# EAGLE design NXP_Smart_Charger (EAGLE 8.4.2)
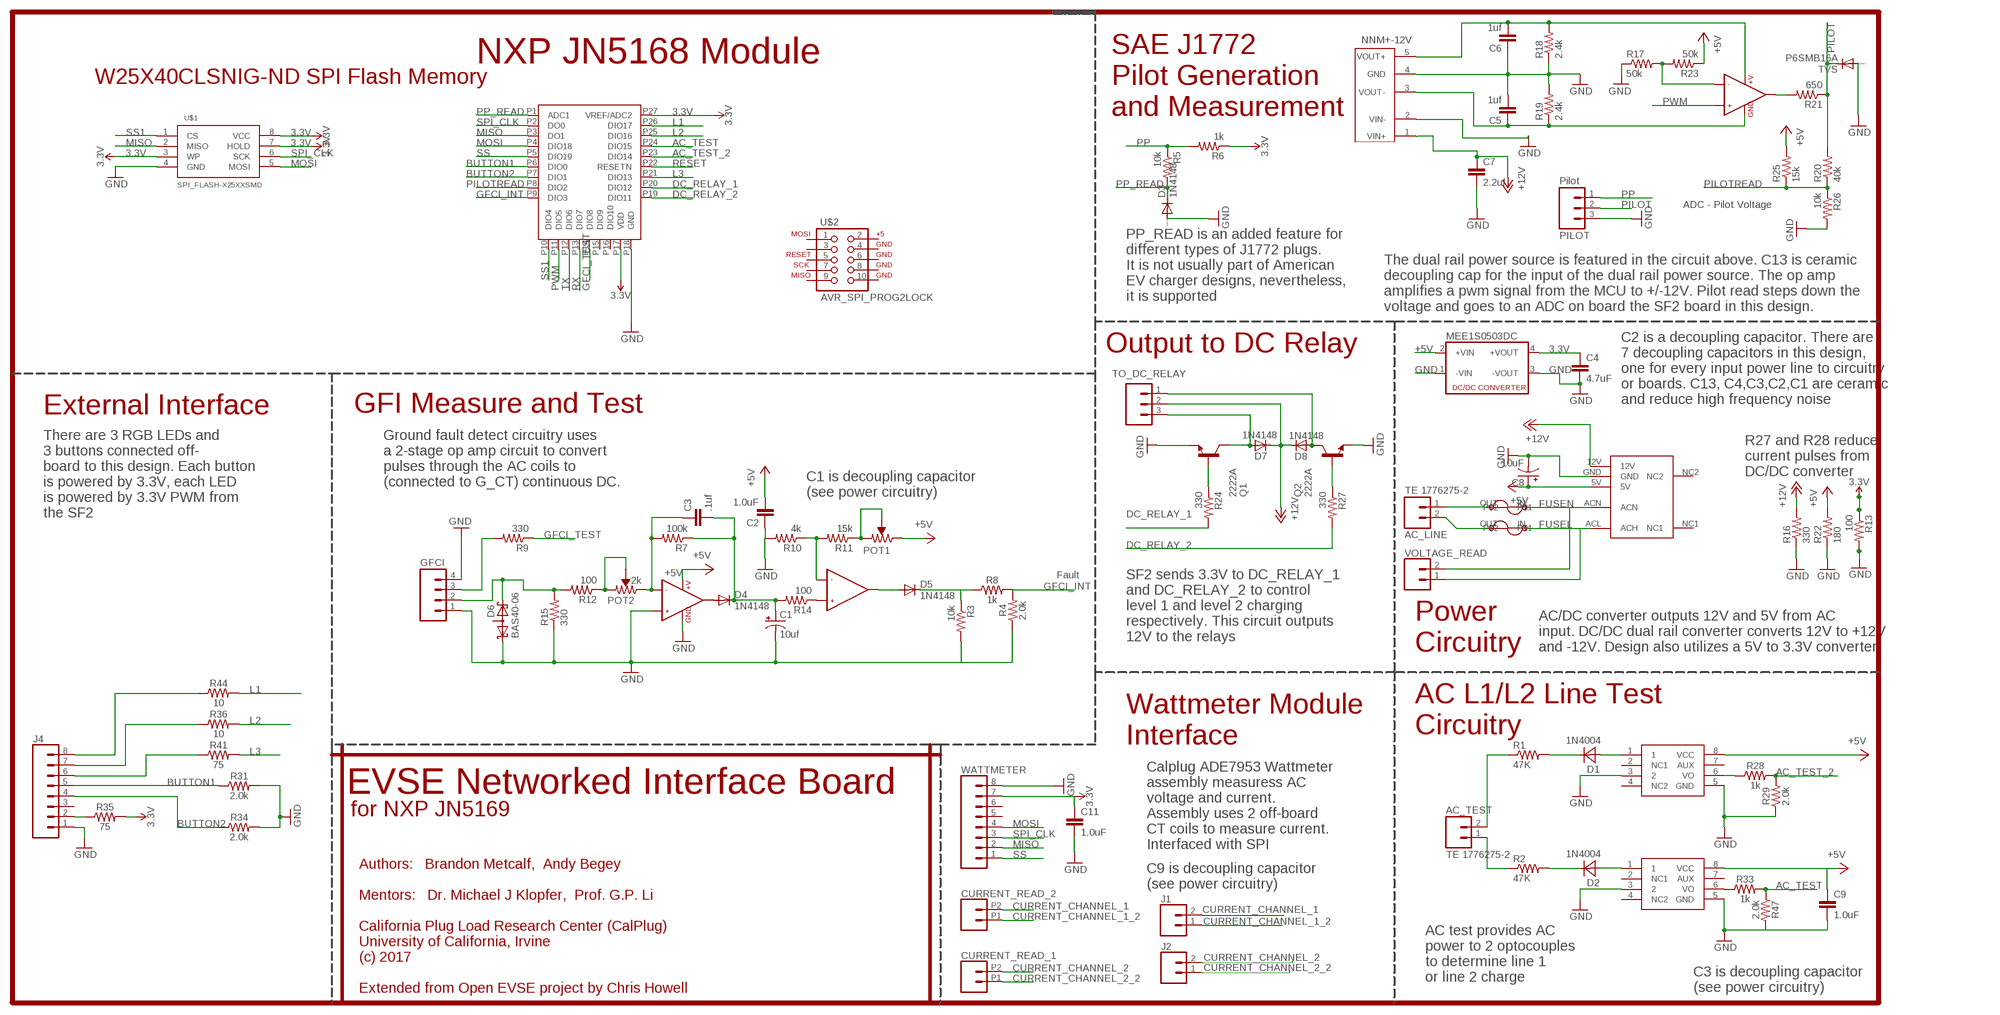
[diagram p0: schematic, sheet 1]

## Parts
AC_LINE  TE 1776275-2  M023.5MM_LOCK  [SCREWTERMINAL-3.5MM-2_LOCK]
AC_TEST  TE 1776275-2  M023.5MM_LOCK  [SCREWTERMINAL-3.5MM-2_LOCK]
C1  10uf  CAP_POL1206  [EIA3216]
C2  1.0uF  1.0UF-0805-25V-(+80/-20%)  [0805]
C3  .1uf  CAP0805  [0805]
C4  4.7uF  1.0UF-0805-25V-(+80/-20%)  [0805]
C5  1uf  CAP0805  [0805]
C6  1uf  CAP0805  [0805]
C7  2.2uf  CAP0805  [0805]
C8  10uF  10UF-POLAR-EIA3216-16V-10%(TANT)  [EIA3216]
C9  1.0uF  1.0UF-0805-25V-(+80/-20%)  [0805]
C11  1.0uF  1.0UF-0805-25V-(+80/-20%)  [0805]
CURRENT_READ_1  CONN_022.54MM_SCREWTERM  [1X02_2.54_SCREWTERM]
CURRENT_READ_2  CONN_022.54MM_SCREWTERM  [1X02_2.54_SCREWTERM]
D1  1N4004  MBRA340T3  [SMA]
D2  1N4004  MBRA340T3  [SMA]
D3  1N4148  DIODE-SOD123  [SOD123]
D4  1N4148  DIODE-SOD123  [SOD123]
D5  1N4148  DIODE-SOD123  [SOD123]
D6  BAS40-06  [SOT23]
D7  1N4148  DIODE-SOD123  [SOD123]
D8  1N4148  DIODE-SOD123  [SOD123]
DC1  MPM-04E-1205  [MPM-04E-1205]
DC2  NNM+-12V  [DIP_5]
F1  BEL1AFUSE  [BELFUSE1A]
F2  BEL1AFUSE  [BELFUSE1A]
GFCI  M04LOCK  [1X04_LOCK]
IC1  MID400  [DIP08]
IC2  MID400  [DIP08]
IC3  LMV358  [SO08]
IC4  LMV358  [SO08]
J1  CONN_02  [1X02]
J2  CONN_02  [1X02]
J4  CONN_08"  [1X08]
JN5168  NXP_JN5168-001-MO3  [MODULE]
MEE1S0503DC  NKE0305DC  [4SIL]
PILOT  Pilot  M03SCREW_LOCK  [SCREWTERMINAL-3.5MM-3_LOCK.007S]
POT1  10k  PVG3G  [PV3G]
POT2  2k  PVG3G  [PV3G]
Q1  2222A  BCX70SMD  [SOT23]
Q2  2222A  BCX70SMD  [SOT23]
R1  47K  RESISTORPTH-1/4W  [AXIAL-0.4]
R2  47K  RESISTORPTH-1/4W  [AXIAL-0.4]
R3  10k  RESISTOR0603-RES  [0603-RES]
R4  2.0k  2.0KOHM-0603-1/10W-5%  [0603]
R5  10k  RESISTOR0603-RES  [0603-RES]
R6  1k  RESISTOR0603-RES  [0603-RES]
R7  100k  RESISTOR0805-RES  [0805]
R8  1k  1KOHM-0603-1/10W-1%  [0603]
R9  330  RESISTOR0603-RES  [0603-RES]
R10  4k  RESISTOR0603-RES  [0603-RES]
R11  15k  RESISTOR0603-RES  [0603-RES]
R12  100  RESISTOR0603-RES  [0603-RES]
R13  100  RESISTOR0603-RES  [0603-RES]
R14  100  RESISTOR0603-RES  [0603-RES]
R15  330  RESISTOR0603-RES  [0603-RES]
R16  330  R-US_R0603  [R0603]
R17  50k  RESISTOR0805-RES  [0805]
R18  2.4k  RESISTOR0603-RES  [0603-RES]
R19  2.4k  RESISTOR0603-RES  [0603-RES]
R20  40k  RESISTOR0603-RES  [0603-RES]
R21  650  RESISTOR0603-RES  [0603-RES]
R22  180  R-US_R0603  [R0603]
R23  50k  RESISTOR0805-RES  [0805]
R24  330  RESISTOR0603-RES  [0603-RES]
R25  15k  RESISTOR0603-RES  [0603-RES]
R26  10k  RESISTOR0603-RES  [0603-RES]
R27  330  RESISTOR0805-RES  [0805]
R28  1k  1KOHM-0603-1/10W-1%  [0603]
R29  2.0k  2.0KOHM-0603-1/10W-5%  [0603]
R31  2.0k  2.0KOHM-0603-1/10W-5%  [0603]
R33  1k  1KOHM-0603-1/10W-1%  [0603]
R34  2.0k  2.0KOHM-0603-1/10W-5%  [0603]
R35  75  75KOHM-0603-1/10W-1%  [0603]
R36  10  10OHM-0603-1/10W-1%  [0603]
R41  75  75KOHM-0603-1/10W-1%  [0603]
R44  10  10OHM-0603-1/10W-1%  [0603]
R47  2.0k  2.0KOHM-0603-1/10W-5%  [0603]
TO_DC_RELAY  M03SCREW_LOCK  [SCREWTERMINAL-3.5MM-3_LOCK.007S]
TVS  P6SMB16A  DIODE-SMB  [SMB]
U$1  SPI_FLASH-X25XXSMD  [SO08]
U$2  AVR_SPI_PROG2LOCK  [2X5-SHROUDED_LOCK]
VOLTAGE_READ  CONN_025MM  [SCREWTERMINAL-5MM-2]
WATTMETER  CONN_08"  [1X08]

## Nets
3.3V: C4.1 C11.1 JN5168.P17(VDD) JN5168.P27(VREF/ADC2) MEE1S0503DC.4(+VOUT) R6.1 R13.1 R35.2 U$1.3(WP) WATTMETER.7
12V: C6.2 DC2.5(VOUT+) IC4.8(+V) R18.2
+5V: C2.2 C8.+ C9.1 DC1.5V IC1.8(VCC) IC2.8(VCC) IC3.8(+V) MEE1S0503DC.2(+VIN) POT1.P$3(CW) R22.2 R23.1 R25.2
+12V: C7.1 D7.C D8.C DC1.12V DC2.1(VIN+) R16.2 TO_DC_RELAY.2
-12V: C5.1 DC2.3(VOUT-) IC4.4(GND) R19.1
AC_TEST: JN5168.P24(DIO15) R33.2 R47.1
AC_TEST_2: JN5168.P23(DIO14) R28.2 R29.2
BUTTON1: J4.5 JN5168.P6(DIO0) R31.1
BUTTON2: J4.4 JN5168.P7(DIO1) R34.1
CURRENT_CHANNEL_1: CURRENT_READ_2.P2 J1.2
CURRENT_CHANNEL_1_2: CURRENT_READ_2.P1 J1.1
CURRENT_CHANNEL_2: CURRENT_READ_1.P2 J2.2
CURRENT_CHANNEL_2_2: CURRENT_READ_1.P1 J2.1
DC_RELAY_1: JN5168.P20(DIO12) R24.2
DC_RELAY_2: JN5168.P19(DIO11) R27.2
FUSEL: DC1.ACL(ACH) F2.IN VOLTAGE_READ.1
FUSEN: DC1.ACN F1.IN VOLTAGE_READ.2
GFCI_INT: JN5168.P9(DIO3) R4.2 R8.2
GFCI_TEST: JN5168.P14(DIO8) R9.1
GND: C1.C(-) C2.1 C4.2 C5.2 C6.1 C7.2 C8.- C9.2 C11.2 D3.A D6.1(K1) DC1.GND DC2.2(VIN-) DC2.4(GND) GFCI.1 GFCI.4 IC1.3 IC1.5(GND) IC2.3 IC2.5(GND) IC3.3(+IN1) IC3.4(GND) J4.1 JN5168.P18(GND) MEE1S0503DC.1(-VIN) MEE1S0503DC.3(-VOUT) PILOT.3 Q1.2(E) Q2.2(E) R3.2 R4.1 R10.2 R13.2 R15.1 R16.1 R17.1 R18.1 R19.2 R22.1 R26.2 R29.1 R31.2 R34.2 R47.2 TVS.A U$1.4(GND)
L1: JN5168.P26(DIO17) R44.2
L2: JN5168.P25(DIO16) R36.2
L3: JN5168.P21(DIO13) R41.2
MISO: JN5168.P3(DO1) U$1.2(MISO) WATTMETER.2
MOSI: JN5168.P4(DIO18) WATTMETER.4
N$1: D8.A Q2.3(C) TO_DC_RELAY.1
N$2: Q2.1(B) R27.1
N$3: IC2.6(VO) R28.1
N$4: D5.C R3.1 R8.1
N$5: POT2.P$1(CCW) POT2.P$2(WIPER) R12.1
N$6: D7.A Q1.3(C) TO_DC_RELAY.3
N$7: POT1.P$1(CCW) POT1.P$2(WIPER) R11.1
N$8: C3.1 IC3.2(-IN1) POT2.P$3(CW) R7.2
N$9: D1.C R1.P$2
N$10: IC4.2(-IN1) R17.2 R23.2
N$11: IC4.1(OUT1) R21.2
N$12: AC_LINE.2 F2.OUT
N$13: AC_LINE.1 F1.OUT
N$14: J4.8 R44.1
N$15: J4.7 R36.1
N$16: J4.6 R41.1
N$17: AC_TEST.2 R1.P$1
N$19: D1.A IC2.1
N$20: D6.2(K2) GFCI.2 R12.2 R15.2
N$21: D4.A IC3.1(OUT1)
N$22: GFCI.3 R9.2
N$23: C1.A(+) C3.2 D4.C R7.1 R14.2
N$24: IC3.6(-IN2) R10.1 R11.2
N$25: D5.A IC3.7(OUT2)
N$26: IC3.5(+IN2) R14.1
N$27: D2.C R2.P$2
N$28: D2.A IC1.1
N$29: AC_TEST.1 R2.P$1
N$30: Q1.1(B) R24.1
N$81: IC1.6(VO) R33.1
N$93: J4.2 R35.1
NC3: WATTMETER.8 ; supply symbol labelled GND
PILOT: PILOT.2 R20.2 R21.1 TVS.C
PILOTREAD: JN5168.P8(DIO2) R20.1 R25.1 R26.1
PP: PILOT.1 R5.1 R6.2
PP_READ: D3.C JN5168.P1(ADC1) R5.2
PWM: IC4.3(+IN1) JN5168.P11(DIO5)
RESET: JN5168.P22(RESETN)
RX: JN5168.P13(DIO7)
SPI_CLK: JN5168.P2(DO0) WATTMETER.3
SS: JN5168.P5(DIO19) WATTMETER.1
SS1: JN5168.P10(DIO4) U$1.1(CS)
TX: JN5168.P12(DIO6)
Unconnected: D6.3(AA) DC1.NC1 DC1.NC2 IC1.2(NC1) IC1.4(NC2) IC1.7(AUX) IC2.2(NC1) IC2.4(NC2) IC2.7(AUX) IC4.5(+IN2) IC4.6(-IN2) IC4.7(OUT2) J4.3 JN5168.P15(DIO9) JN5168.P16(DIO10) U$1.5(MOSI) U$1.6(SCK) U$1.7(HOLD) U$1.8(VCC) U$2.1 U$2.2 U$2.3 U$2.4 U$2.5 U$2.6 U$2.7 U$2.8 U$2.9 U$2.10 WATTMETER.5 WATTMETER.6

## Notes on the sheet
- NXP JN5168 Module
- W25X40CLSNIG-ND SPI Flash Memory
- SAE J1772
  Pilot Generation
  and Measurement
- ADC - Pilot Voltage
- PP_READ is an added feature for
  different types of J1772 plugs.
  It is not usually part of American
  EV charger designs, nevertheless,
  it is supported
- The dual rail power source is featured in the circuit above. C13 is ceramic
  decoupling cap for the input of the dual rail power source. The op amp
  amplifies a pwm signal from the MCU to +/-12V. Pilot read steps down the
  voltage and goes to an ADC on board the SF2 board in this design.
- Output to DC Relay
- C2 is a decoupling capacitor. There are
  7 decoupling capacitors in this design,
  one for every input power line to circuitry
  or boards. C13, C4,C3,C2,C1 are ceramic 
  and reduce high frequency noise
- External Interface | GFI Measure and Test
- R27 and R28 reduce
  current pulses from
  DC/DC converter
- Ground fault detect circuitry uses
  a 2-stage op amp circuit to convert
  pulses through the AC coils to
  (connected to G_CT) continuous DC.
- C1 is decoupling capacitor
  (see power circuitry)
- There are 3 RGB LEDs and
  3 buttons connected off-
  board to this design. Each button
  is powered by 3.3V, each LED
  is powered by 3.3V PWM from
  the SF2
- Fault
- SF2 sends 3.3V to DC_RELAY_1
  and DC_RELAY_2 to control
  level 1 and level 2 charging
  respectively. This circuit outputs
  12V to the relays
- Power
  Circuitry
- AC/DC converter outputs 12V and 5V from AC
  input. DC/DC dual rail converter converts 12V to +12V
  and -12V. Design also utilizes a 5V to 3.3V converter
- AC L1/L2 Line Test
  Circuitry
- Wattmeter Module
  Interface
- EVSE Networked Interface Board
- for NXP JN5169
- Calplug ADE7953 Wattmeter
  assembly measuress AC
  voltage and current. 
  Assembly uses 2 off-board
  CT coils to measure current.
  Interfaced with SPI
- C9 is decoupling capacitor
  (see power circuitry)
- AC test provides AC
  power to 2 optocouples
  to determine line 1
  or line 2 charge
- C3 is decoupling capacitor
  (see power circuitry)
- Authors:   Brandon Metcalf,  Andy Begey
  
  Mentors:   Dr. Michael J Klopfer,  Prof. G.P. Li
  
  California Plug Load Research Center (CalPlug)
  University of California, Irvine
  (c) 2017
  
  Extended from Open EVSE project by Chris Howell

## Library data of the parts
AC_LINE AC_TEST = SparkFun:M02: Header 2 Standard 2-pin 0.1" header. Use with straight break away headers (SKU : PRT-00116), right angle break away headers (PRT-00553), swiss pins (PRT-00743), machine pins (PRT-00117), and female headers (PRT-00115). Molex polarized connector foot print use with SKU : PRT-08233 with associated crimp pins and housings.
C1 = SparkFun:CAP_POL: Capacitor Polarized These are standard SMD and PTH capacitors. Normally 10uF, 47uF, and 100uF in electrolytic and tantalum varieties. Always verify the external diameter of the through hole cap, it varies with capacity, voltage, and manufacturer. The EIA devices should be standard.
C2 C9 C11 = SparkFun-Capacitors:1.0UF: 1µF ceramic capacitors A capacitor is a passive two-terminal electrical component used to store electrical energy temporarily in an electric field.; PROD_ID: CAP-11625
C3 C5-C7 = SparkFun:CAP: Capacitor Standard 0603 ceramic capacitor, and 0.1" leaded capacitor.
C4 = SparkFun-Capacitors:1.0UF: 1µF ceramic capacitors A capacitor is a passive two-terminal electrical component used to store electrical energy temporarily in an electric field.; PROD_ID: CAP-11625; VALUE: 1.0uF
C8 = SparkFun-Capacitors:10UF-POLAR: 10.0µF polarized capacitors A capacitor is a passive two-terminal electrical component used to store electrical energy temporarily in an electric field.; PROD_ID: CAP-00811
CURRENT_READ_1 CURRENT_READ_2 J1 J2 = SparkFun-Connectors:CONN_02: Multi connection point. Often used as Generic Header-pin footprint for 0.1 inch spaced/style header connections On any of the 0.1 inch spaced packages, you can populate with these: Break Away Headers - Straight <https://www.sparkfun.com/products/116> (PRT-00116) Break Away Male Headers - Right Angle <https://www.sparkfun.com/products/553> (PRT-00553) Female Headers <https://www.sparkfun.com/products/115> (PRT-00115) Break Away Headers - Machine Pin <https://www.sparkfun.com/products/117> (PRT-00117) Break Away Female Headers - Swiss Machine Pin <https://www.sparkfun.com/products/743> (PRT-00743) For SCREWTERMINALS and SPRING TERMINALS visit here: Screw Terimnals on SparkFun.com <https://www.sparkfun.com/search/results?term=Screw+Terminals> (5mm/3.5mm/2.54mm spacing) This device is also useful as a general connection point to wire up your design to another part of your project. Our various solder wires solder well into these plated through hole pads. Hook-Up Wire - Assortment (Stranded, 22 AWG) <https://www.sparkfun.com/products/11375> (PRT-11375) Hook-Up Wire - Assortment (Solid Core, 22 AWG) <https://www.sparkfun.com/products/11367> (PRT-11367) View the entire wire category on our website here <https://www.sparkfun.com/categories/141> Special notes: Molex polarized connector foot print use with: PRT-08233 with associated crimp pins and housings. 2.54_SCREWTERM for use with PRT-10571. 3.5mm Screw Terminal footprints for PRT-08084 5mm Screw Terminal footprints for use with PRT-08432
D1 D2 = diode:MBRA340T3: Surface Mount Schottky Power Rectifier Source: http://www.onsemi.com/pub_link/Collateral/MBRA340T3-D.PDF
D3-D5 D7 D8 TVS = diode:DIODE-: DIODE
D6 = diode:BAS40-06: Silicon Schottky Diodes General-purpose diode for high-speed switching
DC1 = Qxd:MPM-04E-1205; SPICEPREFIX: X
DC2 = DCDCconverters:NNM+-12V
F1 F2 = Qxd:BEL1AFUSE
GFCI = SparkFun:M04: Header 4 Standard 4-pin 0.1" header. Use with straight break away headers (SKU : PRT-00116), right angle break away headers (PRT-00553), swiss pins (PRT-00743), machine pins (PRT-00117), and female headers (PRT-00115). Molex polarized connector foot print use with SKU : PRT-08231 with associated crimp pins and housings. 1MM SMD Version SKU: PRT-10208
IC1 IC2 = SparkFun:MID400
IC3 IC4 = SparkFun:LMV358
J4 WATTMETER = SparkFun-Connectors:CONN_08: Multi connection point. Often used as Generic Header-pin footprint for 0.1 inch spaced/style header connections On any of the 0.1 inch spaced packages, you can populate with these: Break Away Headers - Straight <https://www.sparkfun.com/products/116> (PRT-00116) Break Away Male Headers - Right Angle <https://www.sparkfun.com/products/553> (PRT-00553) Female Headers <https://www.sparkfun.com/products/115> (PRT-00115) Break Away Headers - Machine Pin <https://www.sparkfun.com/products/117> (PRT-00117) Break Away Female Headers - Swiss Machine Pin <https://www.sparkfun.com/products/743> (PRT-00743) Arduino Stackable Header - 8 Pin <https://www.sparkfun.com/products/9279> (PRT-09279) For SCREWTERMINALS and SPRING TERMINALS visit here: Screw Terimnals on SparkFun.com <https://www.sparkfun.com/search/results?term=Screw+Terminals> (5mm/3.5mm/2.54mm spacing) This device is also useful as a general connection point to wire up your design to another part of your project. Our various solder wires solder well into these plated through hole pads. Hook-Up Wire - Assortment (Stranded, 22 AWG) <https://www.sparkfun.com/products/11375> (PRT-11375) Hook-Up Wire - Assortment (Solid Core, 22 AWG) <https://www.sparkfun.com/products/11367> (PRT-11367) View the entire wire category on our website here <https://www.sparkfun.com/categories/141> Special notes: Molex polarized connector foot print use with SKU : PRT-08231 with associated crimp pins and housings. 1MM SMD Version SKU: PRT-10208 NOTES ON THE VARIANTS LOCK and LOCK_LONGPADS... This footprint was designed to help hold the alignment of a through-hole component (i.e. 6-pin header) while soldering it into place. You may notice that each hole has been shifted either up or down by 0.005 of an inch from it's more standard position (which is a perfectly straight line). This slight alteration caused the pins (the squares in the middle) to touch the edges of the holes. Because they are alternating, it causes a "brace" to hold the component in place. 0.005 has proven to be the perfect amount of "off-center" position when using our standard breakaway headers. Although looks a little odd when you look at the bare footprint, once you have a header in there, the alteration is very hard to notice. Also,if you push a header all the way into place, it is covered up entirely on the bottom side.; PROD_ID: CONN-08438
JN5168 = Smart_Charger:NXP_JN5168-001-MO3
MEE1S0503DC = NKE0503DC:NKE0305DC
PILOT TO_DC_RELAY = SparkFun:M03: Header 3 Standard 3-pin 0.1" header. Use with straight break away headers (SKU : PRT-00116), right angle break away headers (PRT-00553), swiss pins (PRT-00743), machine pins (PRT-00117), and female headers (PRT-00115). Molex polarized connector foot print use with SKU : PRT-08232 with associated crimp pins and housings.
POT1 POT2 = small_trimmer:PVG3G
Q1 Q2 = transistor-npn:BCX70*: NPN Transistor
R1-R3 R5-R7 R9-R15 R17-R21 R23-R27 = SparkFun:RESISTOR: Resistor Basic schematic elements and footprints for 0603, 1206, and PTH resistors.
R4 R29 R31 R34 R47 = SparkFun-Resistors:2.0KOHM: 2kΩ resistor A resistor is a passive two-terminal electrical component that implements electrical resistance as a circuit element. Resistors act to reduce current flow, and, at the same time, act to lower voltage levels within circuits. - Wikipedia; PROD_ID: RES-08296
R8 R28 R33 = SparkFun-Resistors:1KOHM: 1kΩ resistor A resistor is a passive two-terminal electrical component that implements electrical resistance as a circuit element. Resistors act to reduce current flow, and, at the same time, act to lower voltage levels within circuits. - Wikipedia; PROD_ID: RES-07856
R16 R22 = rcl:R-US_: RESISTOR, American symbol
R35 R41 = SparkFun-Resistors:75KOHM: 75Ω resistor A resistor is a passive two-terminal electrical component that implements electrical resistance as a circuit element. Resistors act to reduce current flow, and, at the same time, act to lower voltage levels within circuits. - Wikipedia; PROD_ID: RES-09737
R36 R44 = SparkFun-Resistors:10OHM: 10Ω resistor A resistor is a passive two-terminal electrical component that implements electrical resistance as a circuit element. Resistors act to reduce current flow, and, at the same time, act to lower voltage levels within circuits. - Wikipedia; PROD_ID: RES-12581
U$1 = SparkFun:SPI_FLASH-X25XX: 8pin SPI Flash series x25xx. Works with devices like W25X32 and BR25L32
U$2 = SparkFun:AVR_SPI_PROG2: AVR ICSP Header This is the standard AVR In Circuit Serial Programming header. Minimal, but includes pin one indicator. Works with standard Olimex programmers. Also look for the 6-pin reduced version. Spark Fun Electronics SKU: PRT-00778
VOLTAGE_READ = SparkFun-Connectors:CONN_02: Multi connection point. Often used as Generic Header-pin footprint for 0.1 inch spaced/style header connections On any of the 0.1 inch spaced packages, you can populate with these: Break Away Headers - Straight <https://www.sparkfun.com/products/116> (PRT-00116) Break Away Male Headers - Right Angle <https://www.sparkfun.com/products/553> (PRT-00553) Female Headers <https://www.sparkfun.com/products/115> (PRT-00115) Break Away Headers - Machine Pin <https://www.sparkfun.com/products/117> (PRT-00117) Break Away Female Headers - Swiss Machine Pin <https://www.sparkfun.com/products/743> (PRT-00743) For SCREWTERMINALS and SPRING TERMINALS visit here: Screw Terimnals on SparkFun.com <https://www.sparkfun.com/search/results?term=Screw+Terminals> (5mm/3.5mm/2.54mm spacing) This device is also useful as a general connection point to wire up your design to another part of your project. Our various solder wires solder well into these plated through hole pads. Hook-Up Wire - Assortment (Stranded, 22 AWG) <https://www.sparkfun.com/products/11375> (PRT-11375) Hook-Up Wire - Assortment (Solid Core, 22 AWG) <https://www.sparkfun.com/products/11367> (PRT-11367) View the entire wire category on our website here <https://www.sparkfun.com/categories/141> Special notes: Molex polarized connector foot print use with: PRT-08233 with associated crimp pins and housings. 2.54_SCREWTERM for use with PRT-10571. 3.5mm Screw Terminal footprints for PRT-08084 5mm Screw Terminal footprints for use with PRT-08432; SF_SKU: PRT-08432

## Board
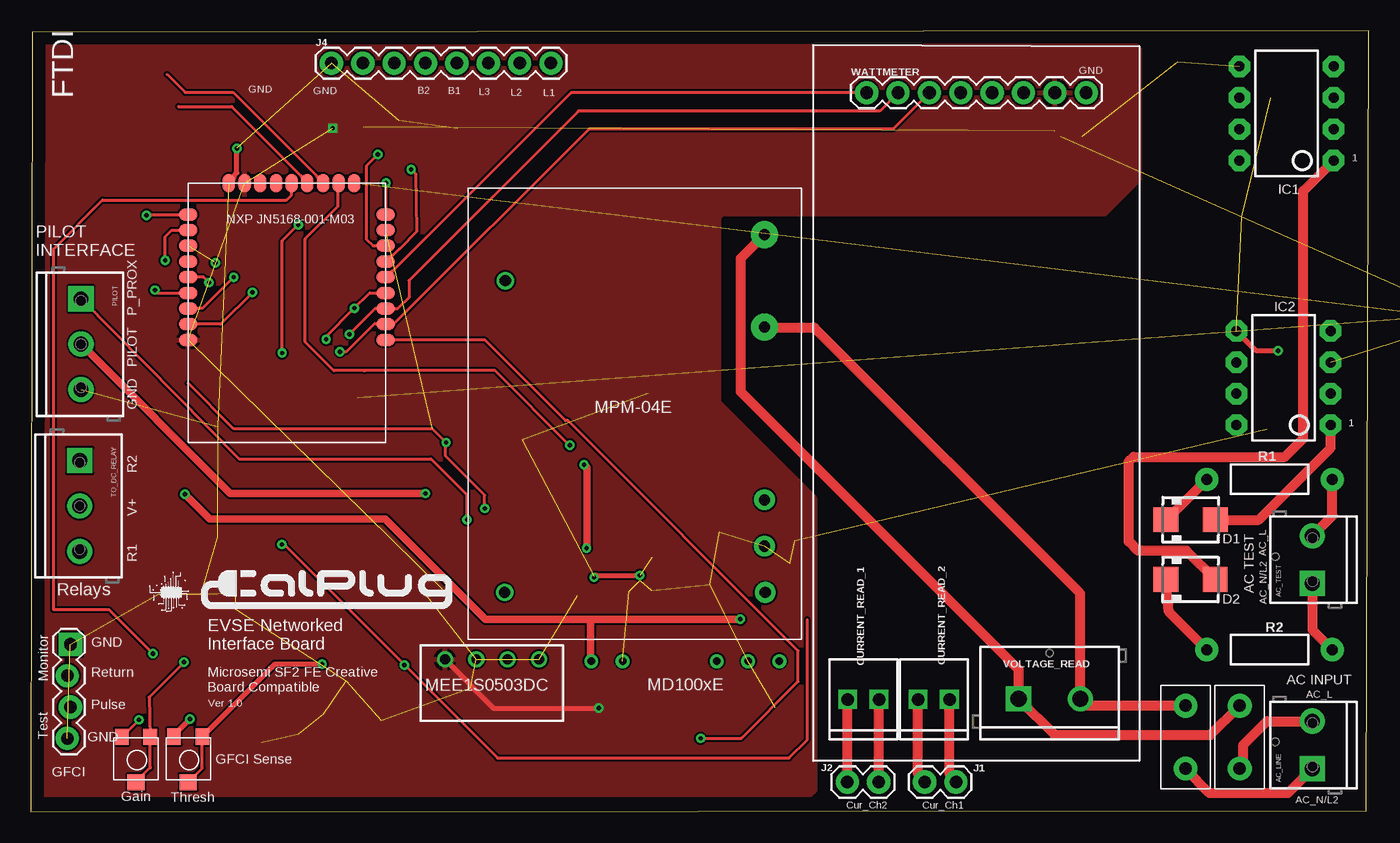
[diagram p1: board, top side]
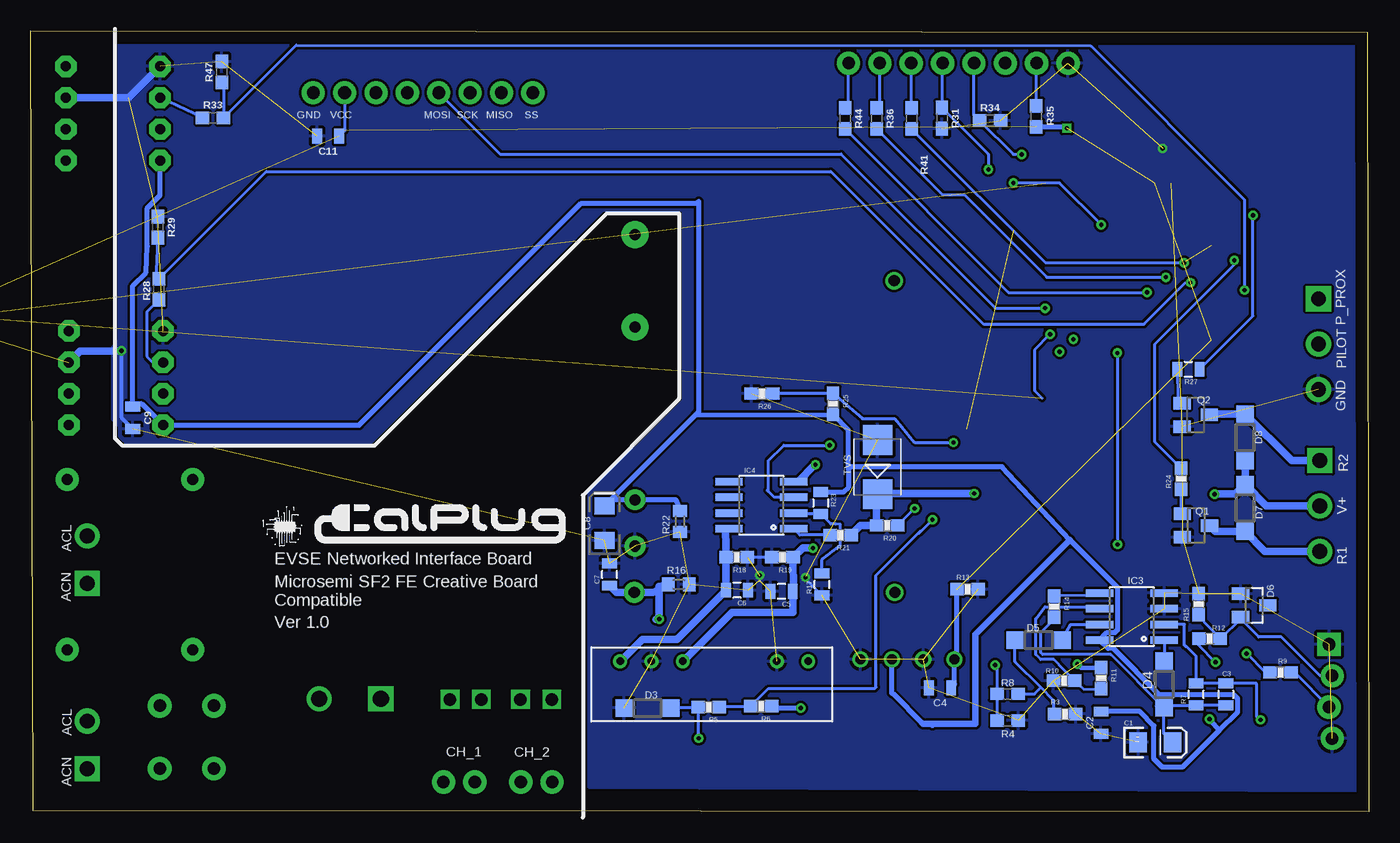
[diagram p2: board, bottom side, seen from below]

Size 108.34 x 63.27 mm. Coordinates in mm from the lower left corner, seen from the top.
Outline: 0,0 108.14,0.1 108.34,63.27 0.1,63.17 0,0
Copper layers (1*16): Top 0.035mm / dielectric 1.5mm / Bottom 0.035mm
Design rules "default": minimum track width 6mil, minimum drill 0.35mm, track to track 6mil, track to pad 6mil, pad to pad 6mil, via to via 6mil, smd to smd 6mil, copper to edge 40mil, drill to drill 6mil, minimum pad ring 10mil, minimum via ring 8mil, stop-mask expansion 4mil, vias tented up to drill 0mil, thermal gap 10mil

### Footprints (pad centres in the part's own frame; a part is rotated, then mirrored left to right if it is on the bottom)
SCREWTERMINAL-3.5MM-2_LOCK = drill 1.2 pad 2.032 square: 1 -0.178,0 | drill 1.2 pad 2.032: 2 3.678,0
EIA3216 = smd 1.4 x 1.6: A 1.4,0; C -1.4,0
0805 = smd 0.8 x 1.2: 1 -0.9,0; 2 0.9,0
EIA3216' = smd 1.4 x 1.6: + 1.4,0; - -1.4,0
1X02_2.54_SCREWTERM = drill 1.016 square: P1 2.54,0; P2 0,0
SMA = smd 2 x 2: A 2,0; C -2,0
SOD123 = smd 1.4 x 1.4: A 1.9,0; C -1.9,0
SOT23 = smd 1 x 1.4: 1 -0.95,-1.1; 2 0.95,-1.1; 3 0,1.1
MPM-04E-1205 = drill 0.9 pad 1.676: 5V 3,25.25; 12V 2.95,32.75; GND 3,29 | drill 0.9 pad 2.184: ACL 3,3.75; ACN 3,11.25 | drill 0.9 pad 1.422: NC1 24,7.5 | drill 0.9: NC2 24.05,32.75
DIP_5 = drill 0.6: 1 1.93,1.13; 2 4.47,1.13; 3 12.09,1.13; 4 14.63,1.13; 5 17.17,1.13
BELFUSE1A = drill 1 pad 1.93: IN 2,1.66; OUT 2,6.74
1X04_LOCK = drill 1.016 pad 1.88 square: 1 0,0.127 | drill 1.016 pad 1.88: 2 2.54,-0.127; 3 5.08,0.127; 4 7.62,-0.127
DIP08 = drill 0.813 pad 1.727 octagon: 1 -3.81,-3.81; 2 -1.27,-3.81; 3 1.27,-3.81; 4 3.81,-3.81; 5 3.81,3.81; 6 1.27,3.81; 7 -1.27,3.81; 8 -3.81,3.81
SO08 = smd 0.61 x 2.21: 1 -1.905,-2.616; 2 -0.635,-2.616; 3 0.635,-2.616; 4 1.905,-2.616; 5 1.905,2.616; 6 0.635,2.616; 7 -0.635,2.616; 8 -1.905,2.616
1X02 = drill 1.016 pad 1.88: 1 0,0; 2 2.54,0
1X08 = drill 1.016 pad 1.88: 1 0,0; 2 2.54,0; 3 5.08,0; 4 7.62,0; 5 10.16,0; 6 12.7,0; 7 15.24,0; 8 17.78,0
MODULE = smd 1.5 x 1: P1 0,10.16; P2 0,8.89; P3 0,7.62; P4 0,6.35; P5 0,5.08; P6 0,3.81; P7 0,2.54; P8 0,1.27; P9 0,0; P19 16,0; P20 16,1.27; P21 16,2.54; P22 16,3.81; P23 16,5.08; P24 16,6.35; P25 16,7.62; P26 16,8.89; P27 16,10.16 | smd 1 x 1.5: P10 2.54,-2.54; P11 3.81,-2.54; P12 5.08,-2.54; P13 6.35,-2.54; P14 7.62,-2.54; P15 8.89,-2.54; P16 10.16,-2.54; P17 11.43,-2.54; P18 12.7,-2.54
4SIL = drill 0.8: 1 1.95,1.13; 2 4.49,1.13; 3 7.03,1.13; 4 9.57,1.13
SCREWTERMINAL-3.5MM-3_LOCK.007S = drill 1.2 pad 2.032 square: 1 -0.178,0 | drill 1.2 pad 2.032: 2 3.5,0; 3 7.178,0
PV3G = smd 1.1 x 1.3: P$1 0,0; P$3 2.3,0 | smd 1.4 x 1.3: P$2 1.15,3.7
AXIAL-0.4 = drill 0.9 pad 1.88: P$1 -5.08,0; P$2 5.08,0
0603-RES = smd 1.1 x 1: 1 -0.85,0; 2 0.85,0
0603 = smd 1.1 x 1: 1 -0.85,0; 2 0.85,0
R0603 = smd 1 x 1.1: 1 -0.85,0; 2 0.85,0
SMB = smd 2.4 x 2.4: A 2.2,0; C -2.2,0
2X5-SHROUDED_LOCK = drill 1.016 pad 1.88 octagon: 1 -1.397,5.08; 2 1.397,5.08; 3 -1.397,2.54; 4 1.397,2.54; 5 -1.397,0; 6 1.397,0; 7 -1.397,-2.54; 8 1.397,-2.54; 9 -1.397,-5.08; 10 1.397,-5.08
SCREWTERMINAL-5MM-2 = drill 1.3 pad 2.032 square: 1 0,0 | drill 1.3 pad 2.032: 2 5,0

### Placement (x,y rotation side)
AC_LINE  103.78,3.68 90 top
AC_TEST  103.78,18.69 90 top
C1  17.27,5.63 0 bottom
C2  21.67,7.23 90 bottom
C3  11.57,9.53 270 bottom
C4  34.71,10.06 180 bottom
C5  47.54,17.86 180 bottom
C6  51.15,17.96 180 bottom
C7  61.47,19.23 90 bottom
C8  10uF  [EIA3216']  61.88,23.39 90 bottom
C9  100.09,31.93 270 bottom
C11  84.27,54.73 180 bottom
CURRENT_READ_1  68.69,9.12 180 top
CURRENT_READ_2  74.39,9.12 180 top
D1  93.92,23.66 0 top
D2  93.91,18.83 0 top
D3  58.39,8.42 180 bottom
D4  16.57,10.33 90 bottom
D5  26.73,13.92 0 bottom
D6  9.27,16.73 270 bottom
D7  10,24.62 270 bottom
D8  10.01,30.34 90 bottom
DC1  62.42,50.53 180 top
DC2  43.45,13.33 180 bottom
F1  95.52,10.26 180 top
F2  99.9,10.26 180 top
GFCI  3.07,13.57 270 top
IC1  101.69,56.58 90 top
IC2  101.45,35.15 90 top
IC3  19.18,15.82 90 bottom
IC4  49.18,24.84 90 bottom
J1  72.38,2.41 0 top
J2  66.13,2.41 0 top
J4  24.34,60.65 0 top
JN5168  28.74,48.4 180 top
MEE1S0503DC  43.1,13.48 180 top
PILOT  4.06,41.39 270 top
POT1  13.89,6.1 180 top
POT2  9.67,6.1 180 top
Q1  13.98,23.2 270 bottom
Q2  14.01,32.16 270 bottom
R1  100.32,26.94 180 top
R2  100.32,13.14 180 top
R3  24.57,7.93 0 bottom
R4  29.23,7.41 180 bottom
R5  53.45,8.5 180 bottom
R6  49.2,8.56 180 bottom
R7  13.97,9.53 90 bottom
R8  29.23,9.56 180 bottom
R9  7.15,11.3 0 bottom
R10  24.67,10.63 180 bottom
R11  21.67,10.83 270 bottom
R12  12.87,14.03 0 bottom
R13  32.48,18.03 0 bottom
R14  25.47,16.63 270 bottom
R15  13.77,16.83 270 bottom
R16  55.87,18.43 180 bottom
R17  44.27,18.43 90 bottom
R18  51.17,20.63 180 bottom
R19  47.47,20.63 180 bottom
R20  39,23.21 180 bottom
R21  42.77,22.43 180 bottom
R22  55.77,23.53 90 bottom
R23  44.37,25.03 270 bottom
R24  15.18,26.99 90 bottom
R25  43.38,33.05 270 bottom
R26  49.13,33.89 180 bottom
R27  14.59,35.86 0 bottom
R28  97.97,42.33 90 bottom
R29  98.05,47.37 270 bottom
R31  34.56,56.19 270 bottom
R33  93.59,56.22 0 bottom
R34  30.66,56 0 bottom
R35  26.92,56.35 270 bottom
R36  39.84,56.18 270 bottom
R41  37.01,56.17 270 bottom
R44  42.39,56.17 270 bottom
R47  92.87,59.93 90 bottom
TO_DC_RELAY  3.96,28.29 270 top
TVS  39.77,27.93 90 bottom
U$1  115.5,42.82 0 top  (outside the outline)
U$2  -17.25,7.49 0 top  (outside the outline)
VOLTAGE_READ  79.99,9.17 0 top
WATTMETER  67.69,58.26 0 top

### Tracks (layer width: path | path; a pad name or v marks a point on that pad's centre or on a via)
3.3V  (via drill 0.35)  (5 unrouted)
  Top 0.406: MEE1S0503DC.4 37.47,8.41 v45.99,8.41
  Bottom 0.254: WATTMETER.7 82.93,55.17 C11.1
  Bottom 0.406: C4.1 33.53,10.34 MEE1S0503DC.4 33.33,12.55 R13.1 | v45.99,8.41 48.2,8.41 R6.1 | R35.2 24.55,55.5 v24.43,55.39
  pour Top: 1.1,62.17 1.1,1.51 0.99,1.41 63.15,1.41 63.48,1.74 63.48,25.4 55.71,33.17 55.71,48.2 56,48.48 86.98,48.48 89.81,51.31 89.81,61.76 89.34,62.24 0.99,62.24 0.9,62.14
12V
  Bottom 0.254: 52.07,22.66 arc90 IC4.8
  Bottom 0.61: 52.07,22.66 R18.2 52.05,20.61 C6.2 56.02,13.99 58.8,13.99 60.58,12.2 DC2.5
+5V  (via drill 0.35)
  Top 0.406: POT1.P$3 11.59,6.23 v12.88,7.52
  Bottom 0.406: R22.2 56.1,25.28 DC1.5V 61.39,25.28 C8.+ 54.52,32.15 | 12.08,6.61 10.61,8.08 10.61,9.18 10.92,9.49 16.94,9.49 20.69,13.23 21.11,13.23 IC3.8 21.19,14.52 20.54,14.52 20.34,14.73 20.34,18.18 24.2,22.04 29.69,27.96 41.96,27.96 42.14,27.78 | R23.1 42.47,25.93 42.14,26.26 42.14,27.78 | 54.52,32.15 R25.2 42.14,30.92 42.14,27.78 | 54.52,32.15 54.25,32.42 54.25,49.47 54.41,49.31 63.78,49.31 81.75,31.34 IC2.8 99.38,33.08 C9.1 100.07,32.84 100.07,42.63 99.01,43.7 98.91,45.83 98.91,48.92 97.88,49.95 IC1.8 | 36.12,7.18 38.53,9.59 arc90 38.61,9.67 MEE1S0503DC.2 | v12.88,7.52 12.88,7.41 12.08,6.61 | 12.08,6.61 15.07,3.63 16.71,3.63 17.38,4.29 17.38,6.99 18.52,8.13 C2.2
  Bottom 0.508: 24.2,22.04 31.84,14.4 31.84,7.13 35.27,7.13 | 35.27,7.13 35.35,7.05 | 35.27,7.13 36.07,7.13 36.12,7.18
+12V  (via drill 0.35)
  Top 0.61: v57.45,15.61 45.33,15.61 | DC2.1 45.33,12.25 45.33,15.61 | v12.47,25.74 14.46,23.74 28.67,23.74 36.81,15.61 45.33,15.61
  Bottom 0.61: TO_DC_RELAY.2 8.27,24.79 D7.C | C7.1 60.92,17.78 DC1.12V 57.94,17.78 R16.2 57.45,18.27 v57.45,15.61 57.71,15.61 | v12.47,25.74 10.78,25.74 D7.C | D7.C D8.C
-12V  (via drill 0.35)
  Top 0.61: v44.8,28.13 45.03,27.9 45.03,21.4 v45.01,21.37
  Bottom 0.61: IC4.4 46.22,26.75 44.83,28.13 v44.8,28.13 | v45.01,21.37 45.83,21.37 R19.1 46.57,17.93 | C5.1 46.57,17.93 | DC2.3 51.57,16.18 46.61,16.18 46.61,17.89 46.57,17.93
AC_TEST  (via drill 0.35)
  Top 0.254: v10.05,42.27 10.27,42.05 JN5168.P24
  Bottom 0.254: R47.1 92.74,58.95 R33.2 86.85,62.11 22.51,62.05 10.05,49.59 v10.05,42.27
AC_TEST_2  (via drill 0.35)
  Top 0.254: v14.43,42.88 13.99,43.32 JN5168.P23
  Bottom 0.254: R29.2 98.22,42.93 R28.2 89.28,51.87 43.55,51.87 31.19,39.51 18.2,39.51 14.84,42.88 v14.43,42.88
BUTTON1  (via drill 0.35)
  Top 0.254: v30.79,52.04 31.14,51.69 31.22,46.99 29.84,45.61 29.77,45.54 29.31,45.08 29.23,45.08 JN5168.P6
  Bottom 0.254: J4.5 34.56,60.6 R31.1 30.79,53.28 v30.79,52.04
BUTTON2  (via drill 0.35)
  Top 0.254: v28.11,53.27 27.17,52.33 27.17,46.39 27.7,45.86 JN5168.P7
  Bottom 0.254: J4.4 31.96,56.46 R34.1 28.78,53.27 v28.11,53.27
CURRENT_CHANNEL_1
  Top 0.813: J1.2 74.39,3.08 CURRENT_READ_2.P2
CURRENT_CHANNEL_1_2
  Top 0.813: J1.1 71.85,3.08 CURRENT_READ_2.P1
CURRENT_CHANNEL_2
  Top 0.813: J2.2 68.67,9.09 CURRENT_READ_1.P2
CURRENT_CHANNEL_2_2
  Top 0.813: J2.1 66.13,9.09 CURRENT_READ_1.P1
DC_RELAY_1  (via drill 0.35)
  Top 0.254: v10.88,44.68 10.88,46.61 11.4,47.13 JN5168.P20
  Bottom 0.254: R24.2 17.32,29.98 17.32,37.88 10.88,44.32 v10.88,44.68
DC_RELAY_2  (via drill 0.35)
  Top 0.254: v9.37,48.33 9.44,48.4 JN5168.P19
  Bottom 0.254: R27.2 9.37,40.18 v9.37,48.33
FUSEL
  Top 0.813: F2.IN 95.54,6.24 82.93,6.24 VOLTAGE_READ.1 79.99,11.53 57.48,34.05 57.48,44.84 DC1.ACL
FUSEN
  Top 0.813: DC1.ACN 59.5,39.2 63.48,39.2 84.99,17.69 VOLTAGE_READ.2 85.56,8.6 F1.IN
GFCI_INT  (via drill 0.35)
  Top 0.254: 62.89,15.59 62.89,5.86 61.41,4.37 37.78,4.37 v30.26,11.9 20.49,21.66 v20.32,21.66 | v20.35,37.18 20.35,46.27 v21.65,47.56 | v28.77,50.95 28.74,50.92 JN5168.P9
  Bottom 0.254: R4.2 30.08,8.01 R8.2 30.08,11.73 v30.26,11.9 | v20.32,21.66 20.32,37.15 v20.35,37.18 | v21.65,47.56 25.04,50.95 v28.77,50.95
GFCI_TEST  (via drill 0.35)
  Top 0.254: v9.88,12.83 6.33,16.38 1.84,16.38 1.84,45.6 5.8,49.56 20.7,49.56 21.12,49.97 JN5168.P14
  Bottom 0.254: R9.1 8.35,11.3 v9.88,12.83
GND  (via drill 0.35)  (41 unrouted)
  Top 0.406: v101.01,37.35 99.25,37.35 IC2.5 | v45.61,19 45.78,19.17 v49.32,19.17 | JN5168.P18 16.45,51.35 16.45,51.54 16.68,51.78 v16.68,53.76
  Bottom 0.254: R19.2 R18.1 | R17.1 45.61,18.87 v45.61,19 45.61,19.09 | v49.32,19.17 49.32,18.74
  Bottom 0.305: v101.01,37.35 101.01,31.95 C9.2
  Bottom 0.61: IC1.5 100.42,57.85 IC1.3 | v101.01,37.35 104.33,37.35 IC2.3
  pour Bottom (isolate 0.203): 0.84,62.4 101.22,62.4 101.22,38.19 101.73,37.67 101.73,31.78 101.17,31.22 101.17,30.4 100.75,29.98 80.71,29.98 61.95,48.74 56.66,48.74 55.54,48.71 55.54,33.32 63.17,25.81 63.17,2 0.86,1.71 0.86,62.1 1.01,62.25
L1  (via drill 0.35)
  Top 0.254: v17.94,42.08 15.37,39.51 JN5168.P26
  Bottom 0.254: R44.2 29.16,42.08 v17.94,42.08
L2  (via drill 0.35)
  Top 0.254: v16.42,43.32 13.88,40.78 JN5168.P25
  Bottom 0.254: R36.2 34.51,50 32.75,50 26.07,43.32 v16.42,43.32
L3  (via drill 0.35)  (1 unrouted)
  Top 0.254: v14.94,44.48 14.83,44.59
  Bottom 0.254: R41.2 26.17,44.48 v14.94,44.48
MISO  (via drill 0.35)  (1 unrouted)
  Top 0.254: WATTMETER.2 68.75,56.78 44.35,56.78 30.61,43.05 30.61,41.67 29.72,40.78 JN5168.P3 27.88,40.78 v25.8,38.7
  Bottom 0.254: 26.44,33.52 27.02,34.1 27.02,37.47 v25.8,38.7
MOSI  (via drill 0.35)
  Top 0.254: JN5168.P4 27.44,42.05 v26.2,40.81 23.91,38.52 v23.91,38.29
  Bottom 0.254: WATTMETER.4 70.34,53.3 42.73,53.3 30.24,40.81 v26.2,40.81 | v23.9,38.28 v23.91,38.29
N$1
  Bottom 0.254: D8.A 9.64,31.87
  Bottom 0.61: Q2.3 12.83,32.24 D8.A 6.24,28.47 TO_DC_RELAY.1
N$2
  Bottom 0.254: R27.1 15.47,33.47 Q2.1
N$3
  Bottom 0.254: R28.1 98.96,40.49 98.96,36.89 98.48,36.42 IC2.6
N$4
  Bottom 0.254: 26.54,10.07 25.53,9.06 25.53,7.99 R3.1 | R8.1 27.05,9.56 26.54,10.07 | 26.54,10.07 28.63,12.16 D5.C
N$5  (via drill 0.35)
  Top 0.254: v12.4,12.13 9.56,9.29 POT2.P$1 9.67,3.63 | 9.67,3.63 9.67,3.55 | POT2.P$2 8.52,2.48 9.67,3.63
  Bottom 0.254: v12.4,12.13 13.77,13.5 R12.1
N$6
  Bottom 0.61: Q1.3 12.4,22.72 D7.A 8.39,21.11 TO_DC_RELAY.3
N$7  (via drill 0.35)
  Top 0.254: POT1.P$2 13.89,3.55 POT1.P$1
  Top 0.406: POT1.P$1 19.76,11.98 v23.59,11.98
  Bottom 0.406: v23.59,11.98 23.33,11.73 R11.1
N$8  (via drill 0.35)
  Top 0.254: POT2.P$3 7.4,6.1 v8.76,7.46
  Bottom 0.152: 16.1,15.19 16.4,15.19 IC3.2
  Bottom 0.254: C3.1 R7.2 13.97,12.61 14.77,13.41 14.82,13.41 14.91,13.49 14.91,15.22 14.94,15.19 16.4,15.19 | 11.44,10.56 C3.1 | C3.1 11.54,10.4 9.1,10.4 9.06,10.36 9.06,7.72 v8.76,7.46
N$9
  Top 0.813: D1.C 91.96,23.66 R1.P$2
N$10
  Bottom 0.254: IC4.2 46.49,24.13 R23.2 43.55,23.31 43.15,23.31 42.78,23.3 42.78,21.57 44.27,20.44 R17.2
N$11
  Bottom 0.254: R21.2 46.06,22.43 IC4.1
N$12
  Top 0.813: F2.OUT 98.21,3.83 98.21,5.45 100.11,7.36 AC_LINE.2
N$13
  Top 0.813: AC_LINE.1 101.79,1.52 95.45,1.51 93.52,3.44 F1.OUT
N$14
  Bottom 0.254: R44.1 42.12,57.28 J4.8
N$15
  Bottom 0.254: R36.1 39.58,57.29 J4.7
N$16
  Bottom 0.254: R41.1 37.04,57.05 J4.6
N$17
  Top 0.813: AC_TEST.2 105.4,23.99 R1.P$1
N$19
  Top 0.813: D1.A 99.43,23.66 105.26,29.49 IC2.1
N$20
  Bottom 0.254: 10.37,15.63 D6.2 | 10.37,15.63 R12.2 13.77,15.83 R15.2 | GFCI.2 3.93,11.03 7.06,14.17 8.91,14.17 10.37,15.63
N$21
  Bottom 0.254: IC3.1 16.56,12.24 D4.A
N$22
  Bottom 0.254: GFCI.3 5.96,11.25 R9.2
N$23
  Bottom 0.254: C3.2 R7.1 16.37,8.63 16.42,8.58 | 16.42,8.58 D4.C | 25.47,15.55 R14.2 25.47,15.63 26.55,14.55 26.55,12.91 26.39,12.75 20.89,12.75 D4.C | 17.2,8.58 16.42,8.58 | C1.A 16.57,6.33 D4.C
N$24
  Bottom 0.254: R11.2 23.07,9.93 R10.1 25.48,12.34 26.55,12.34 26.96,12.75 26.96,15.64 26.22,16.62 21.97,16.62 21.89,16.36 IC3.6
N$25
  Bottom 0.254: D5.A 24.11,15.19 IC3.7
N$26
  Bottom 0.254: IC3.5 21.99,17.53 R14.1
N$27
  Top 0.813: R2.P$2 92.16,16.22 D2.C
N$28
  Top 0.813: D2.A 93.59,21.14 89.67,21.14 88.91,21.9 88.91,28.37 89.31,28.77 101.56,28.77 103.03,30.25 103.03,50.3 IC1.1
N$29
  Top 0.813: AC_TEST.1 103.78,14.76 R2.P$1
N$30
  Bottom 0.254: Q1.1 15.17,24.24 R24.1
N$81
  Bottom 0.254: R33.1 IC1.6
N$93
  Bottom 0.254: R35.1 26.92,60.62 J4.2
PILOT  (via drill 0.35)
  Top 0.61: PILOT.2 16.15,25.8 v31.94,25.8
  Bottom 0.254: R21.1 41.67,22.63 | 39.38,26.12 39.63,25.87 TVS.C
  Bottom 0.61: v31.94,25.8 39.56,25.8 39.63,25.87 | TVS.C 39.85,25.65 R20.2 41.14,23.21 R21.1
PILOTREAD  (via drill 0.35)  (1 unrouted)
  Top 0.254: v36.76,24.58 36.76,25.66 33.61,28.81 33.61,29.95 v33.63,29.93 32.52,31.04 16.43,31.04 12.74,34.73
  Bottom 0.254: R26.1 43.45,33.89 43.38,33.95 R25.1 41.01,31.86 38.38,31.86 36.77,29.93 v33.63,29.93 | R20.1 36.78,24.58 v36.76,24.58
PP  (via drill 0.35)
  Top 0.254: PILOT.1 16.85,28.61 32.41,28.61 35.29,25.73 35.29,23.69 v35.32,23.66 35.01,23.66
  Bottom 0.254: 50.16,8.5 R5.1 | 50.16,8.5 R6.2 48.6,10.01 40.01,10.01 39.9,10.12 39.9,19.16 36.46,22.6 | 50.1,8.56 50.16,8.5 | 36.46,22.6 36.31,22.75 | 36.46,22.6 36.38,22.6 v35.32,23.66
PP_READ  (via drill 0.35)
  Top 0.254: v54.24,5.96 57.54,5.96 62.13,10.56 62.13,13.06 43.48,31.71 43.3,31.71 36.79,38.22 28.75,38.22 JN5168.P1
  Bottom 0.254: D3.C 54.38,8.42 R5.2 54.3,6.02 v54.24,5.96
PWM  (via drill 0.35)
  Top 0.254: v43.64,29.7 37.6,35.74 27.05,35.74 | 27.05,35.74 26.97,35.74 | 27.05,35.74 24.54,35.74 22.23,38.05 22.23,46.43 24.87,49.07 24.87,50.88 JN5168.P11
  Bottom 0.254: IC4.3 48.12,25.48 48.59,25.94 | 48.59,25.94 48.71,26.06 | 48.59,25.94 48.59,28.47 47.36,29.7 v43.64,29.7
RX
  Top 0.254: JN5168.P13 21.9,51.43 21.9,51.51 16.27,57.13 11.93,57.13
SPI_CLK  (via drill 0.35)
  Top 0.254: WATTMETER.3 69.83,55.32 45.2,55.32 29.38,39.51 JN5168.P2 28.68,39.56 27.86,39.56 25.57,37.28 v25.04,37.28
  Bottom 0.254: 25.17,37.14 v25.04,37.28
SS
  Top 0.254: JN5168.P5 29.23,43.81 29.31,43.81 43.76,58.26 WATTMETER.1
SS1  (1 unrouted)
TX
  Top 0.254: 11.03,59.75 12.49,58.29 16.38,58.29 23.17,51.51 23.17,51.43 JN5168.P12

### Text on the board
tPlace: GND | GND | GND | B2 | B1 | L3 | L2 | L1 | FTDI | 1 | PILOT / INTERFACE | P_PROX | PILOT | GND | MPM-04E | 1 | R2 | V+ | AC TEST | AC_L | R1 | AC_N/L2 | Relays | Monitor | GND | EVSE Networked / Interface Board | Return | Microsemi SF2 FE Creative / Board Compatible | MD100xE | AC INPUT | Ver 1.0 | AC_L | Test | Pulse | GND | GFCI Sense | Gain | Thresh | AC_N/L2 | Cur_Ch2 | Cur_Ch1
bPlace: SS | MISO | SCK | MOSI | VCC | GND | P_PROX | PILOT | GND | R2 | V+ | ACL | R1 | EVSE Networked Interface Board | ACN | Microsemi SF2 FE Creative Board / Compatible | Ver 1.0 | ACL | CH_2 | CH_1 | ACN